# EasyEDA Pro project CogletESP_2026-02-24.epro, board Proto-Coglet_Reworked
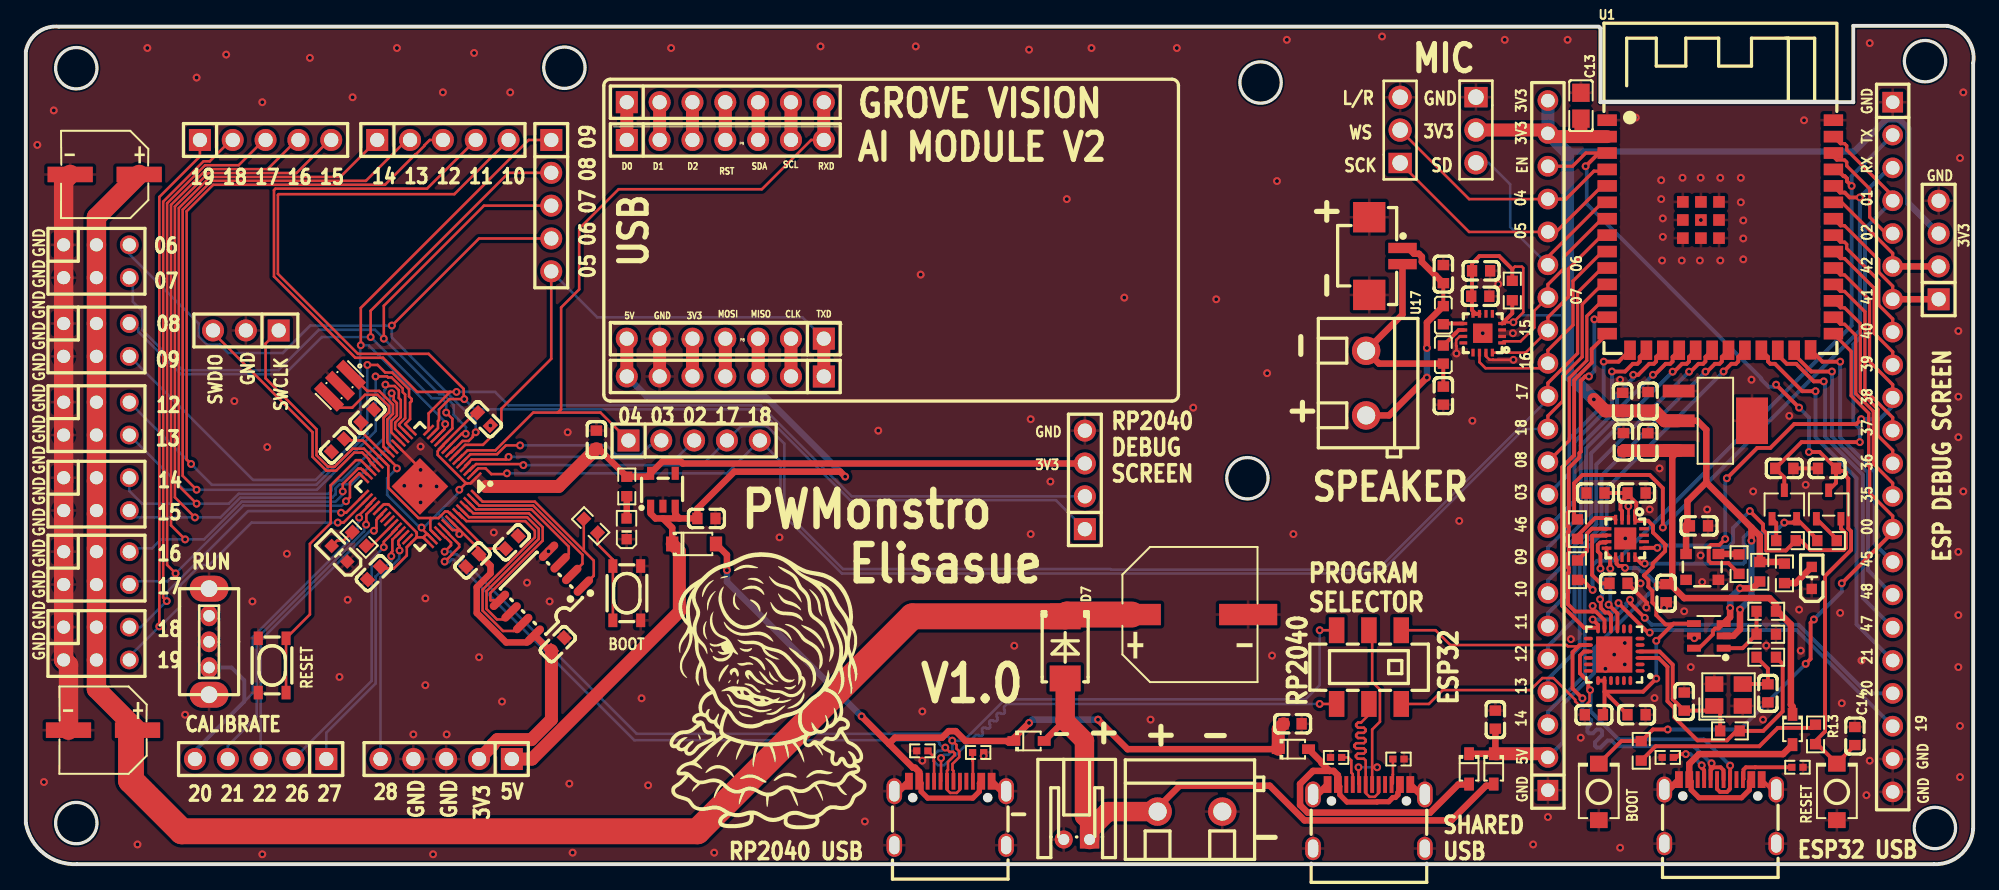
[diagram p7: board, top side]
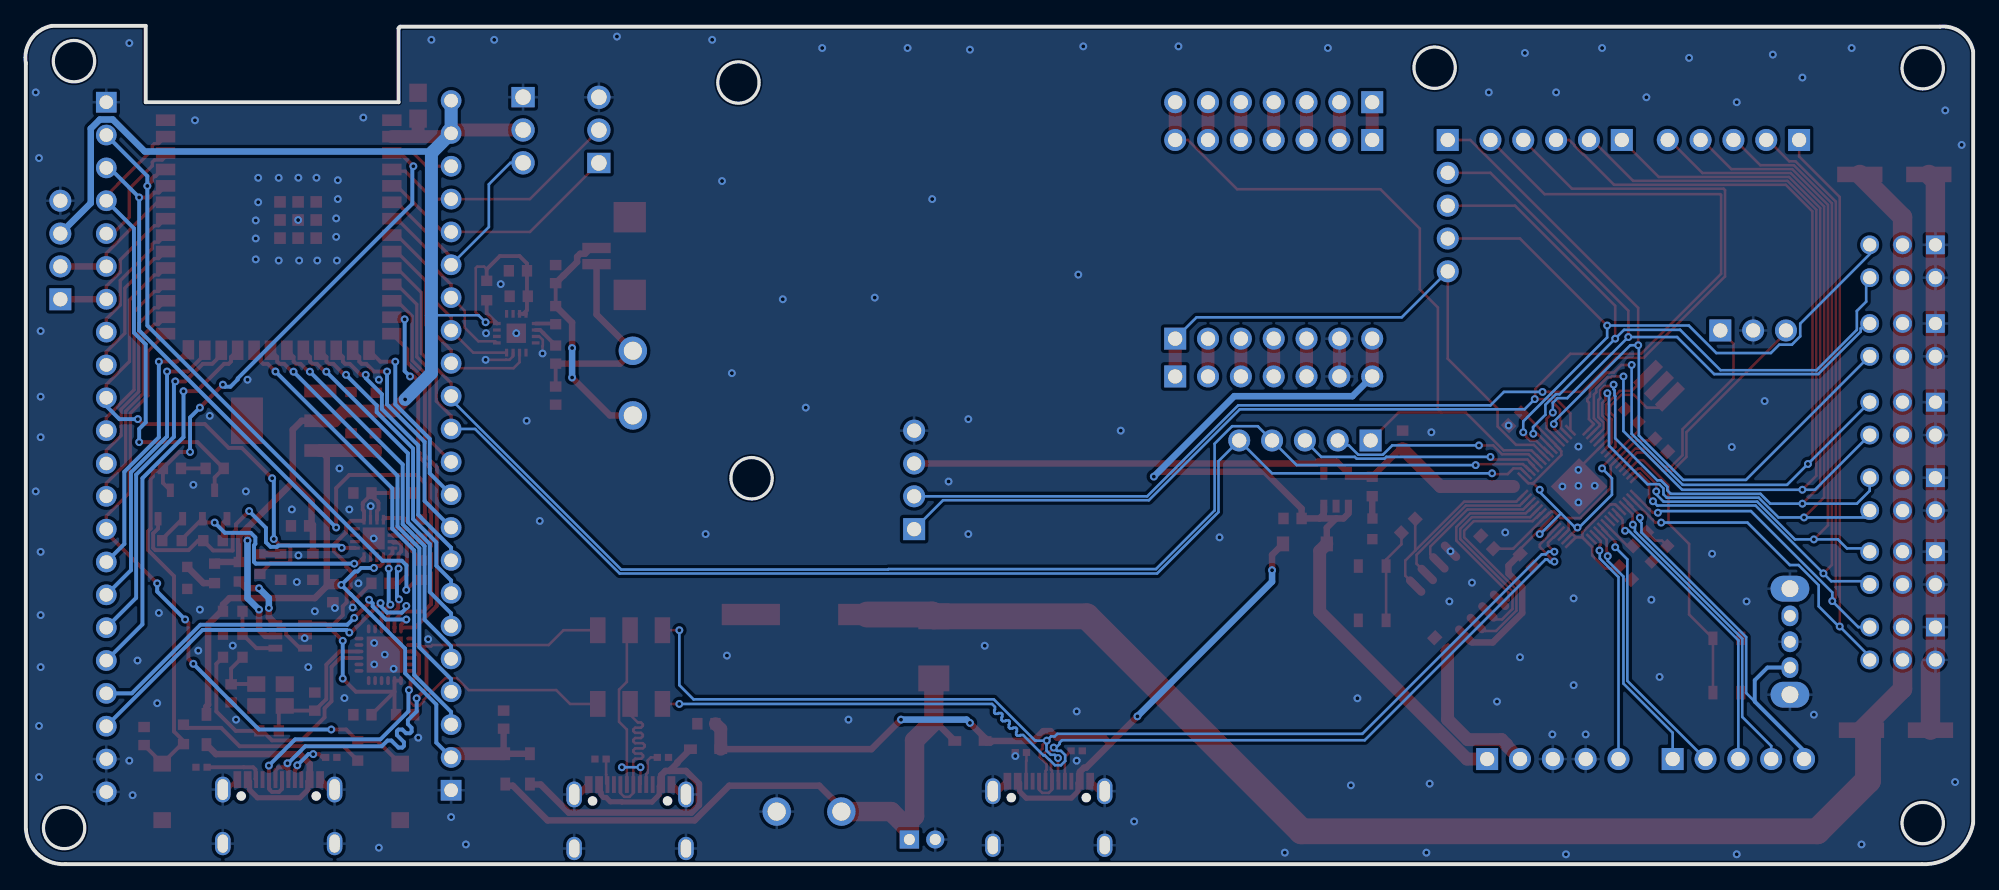
[diagram p8: board, bottom side, seen from below]

Outline 150.62 x 64.83 mm; copper layers: Top Layer, Bottom Layer. Coordinates in mm from the lower left corner of the outline.
Outline path: circle c3.9,61.56 r1.6 ; circle c3.9,3.17 r1.6 ; circle c41.66,61.59 r1.6 ; circle c94.49,29.84 r1.6 ; circle c95.5,60.45 r1.6 ; circle c146.9,62.1 r1.6 ; circle c147.66,2.79 r1.6 ; 0,62.86 0,3.17 arc(1.37,0.85) 3.94,0 147.57,0 arc(149.66,0.74) 150.62,2.72 150.62,61.94 arc(150.21,63.79) 148.62,64.83 141.35,64.83 141.35,58.93 121.79,58.93 121.79,64.64 121.67,64.77 2.58,64.77 arc(0.92,64.32) 0,62.86
Stack: Top Layer 0.035mm / Dielectric1 1.51mm FR4 er 4.5 / Bottom Layer 0.035mm

## Design rules (mm)
net USB_DM: DP1
net USB_DP: DP1
net D_N: DP3
net D_P: DP3
net DNIN: DP2
net DPIN: DP2
template: JLCPCB Capability(Two Layers Board)
spacing copperThickness1oz (default): track to track 0.102, other pairs 0.152 to 0.3
spacing copperThickness2oz: track to track 0.203, other pairs 0.152 to 0.3
track width copperThickness1oz (default): min 0.127, default 0.254, max 2.54
track width copperThickness2oz: min 0.203, default 0.254, max 2.54
differential pair differentialPair (default): width min 0.127, default 0.254, max 2.54; gap min 0.152, default 0.152
via viaSize (default): diameter min 0.5, default 0.61, max 10; hole min 0.3, default 0.305, max 6.3

## Placement (name value [footprint] x y rotation side)
C1  1uF  [C0603]  52.64 26.73 180 top
C2  10uF  [C0603]  113.67 11.18 270 top
C3  220uF  [CAP-SMD_BD6.3-L6.6-W6.6-FD]  5.97 10.36 180 top
C4  1uF  [C0603]  26.42 34.67 225 top
C5  1uF  [C0603]  24.13 32.38 45 top
C6  100nF  [C0603]  26.92 22.5 45 top
C7  100nF  [C0603]  34.54 23.49 45 top
C8  100nF  [C0603]  35.43 34.42 135 top
C9  100nF  [C0603]  37.59 24.89 225 top
C10  10uF  [C0603]  97.98 10.86 180 top
C11  1uF  [C0603]  44.13 32.83 270 top
C12  1uF  [C0603]  41.15 17.02 225 top
C13  10uF  [C0805]  120.28 58.66 270 top
C14  1uF  [C0603]  141.48 9.91 270 top
C15  1000uF  [CAP-SMD_BD10.0-L10.3-W10.3-FD]  90.04 19.3 0 top
C16  1uF  [C0603]  121.28 11.56 0 top
C17  1uF  [C0603]  124.59 11.56 180 top
C18  15pF  [C0603]  128.27 12.57 90 top
C19  15pF  [C0603]  134.75 13.21 270 top
C20  100nF  [C0603]  129.42 26.16 180 top
C21  220uF  [CAP-SMD_BD6.3-L6.6-W6.6-FD]  6.1 53.34 180 top
C22  100nF  [C0603]  124.59 28.7 0 top
C23  100nF  [C0603]  121.41 28.7 0 top
C24  100nF  [C0603]  123.19 21.72 180 top
C25  4.7uF  [C0603]  139.32 30.61 0 top
C26  1uF  [C0603]  136.02 30.61 180 top
C27  100nF  [C0603]  123.57 32.64 270 top
C30  100nF  [C0603]  123.51 35.75 270 top
C32  10uF  [C0603]  125.46 32.62 270 top
C33  10uF  [C0603]  125.48 35.81 270 top
C34  10uF  [C0603]  126.87 20.95 90 top
C35  10uF  [C0603]  112.5 43.92 180 top
C36  100nF  [C0603]  112.56 45.89 180 top
C37  220pF  [C0603]  109.64 36.23 90 top
C38  220pF  [C0603]  109.64 45.63 270 top
CN1  HC-1.25-2PWT  [CONN-SMD_2P-P1.25-HC-1.25-2PWT]  105.2 47.03 270 top
D1  DSK34  [SOD-123_L2.8-W1.8-LS3.7-RD]  51.69 24.76 0 top
D2  B5819WS  [SOD-323_L1.8-W1.3-LS2.5-RD]  113.54 7.37 270 top
D3  B5819WS  [SOD-323_L1.8-W1.3-LS2.5-RD]  136.65 10.41 270 top
D4  B5819WS  [SOD-323_L1.8-W1.3-LS2.5-RD]  98.04 8.89 0 top
D5  B5819WS  [SOD-323_L1.8-W1.3-LS2.5-RD]  111.63 7.37 270 top
D6  B5819WS  [SOD-323_L1.8-W1.3-LS2.5-RD]  77.6 9.53 0 top
D7  SS1045-SMB  [SMB_L4.4-W3.6-LS5.3-RD]  80.39 16.76 270 top
H1  PZ254V-11-05P  [HDR-TH_5P-P2.54-V-M]  32.51 8.13 180 top
H7  X6511WV-03H-C60D30  [HDR-TH_3P-P2.54-V-M]  17.02 41.27 180 top
H8  PZ254V-11-04P  [HDR-TH_4P-P2.54-V-M]  147.95 47.5 90 top
H9  PZ254V-11-04P  [HDR-TH_4P-P2.54-V-M]  81.92 29.72 90 top
H11  2.54-1*3P针  [HDR-TH_3P-P2.54-V-M-1]  106.3 56.77 90 top
H12  2.54-1*3P针  [HDR-TH_3P-P2.54-V-M-1]  112.16 56.78 270 top
H13  PZ254V-11-05P  [HDR-TH_5P-P2.54-V-M]  51.69 32.77 0 top
H14  PZ254V-11-05P  [HDR-TH_5P-P2.54-V-M]  40.64 50.93 270 top
H15  PZ254V-11-05P  [HDR-TH_5P-P2.54-V-M]  32.26 56.01 0 top
H16  PZ254V-11-05P  [HDR-TH_5P-P2.54-V-M]  18.54 56.01 0 top
H17  PZ254V-11-05P  [HDR-TH_5P-P2.54-V-M]  18.16 8.13 180 top
L1  BLM18PG121SN1D  [L0603]  109.64 42.46 270 top
L2  BLM18PG121SN1D  [L0603]  109.64 39.41 90 top
LED1  SML-D12P8WT86  [LED0603-RD_GREEN]  46.47 25.93 90 top
LED2  SML-D12D8WT86  [LED0603-R-RD_AMBER]  24.26 24 135 top
LED3  SML-D12D8WT86  [LED0603-R-RD_AMBER]  138.14 22.14 90 top
Q1  FDC6333C  [SOT-23-6_L2.9-W1.6-P0.95-LS2.8-BL]  130.18 17.65 90 top
Q2  S8050  [SOT-23-3_L3.0-W1.7-P0.95-LS2.9-BR]  136.02 27.81 270 top
Q3  S8050  [SOT-23-3_L3.0-W1.7-P0.95-LS2.9-BR]  139.45 27.81 270 top
R7  1kΩ  [R0603]  25.78 25.15 315 top
R8  1kΩ  [R0603]  46.48 29.21 90 top
R9  1kΩ  [R0603]  43.69 26.16 135 top
R11  5.1kΩ  [R0402]  69.34 8.76 0 top
R12  5.1kΩ  [R0402]  73.66 8.64 180 top
R13  10kΩ  [R0603]  138.43 10.03 90 top
R14  10kΩ  [R0603]  124.95 8.76 270 top
R15  100kΩ  [R0603]  134.62 19.56 180 top
R16  100kΩ  [R0603]  134.62 17.78 0 top
R17  100kΩ  [R0603]  134.12 22.61 270 top
R18  1kΩ  [R0603]  134.62 16 0 top
R19  1kΩ  [R0603]  131.81 10.3 180 top
R20  0Ω  [R0603]  132.52 23.2 90 top
R21  10kΩ  [R0603]  136.03 22.49 90 top
R22  0Ω  [R0603]  120.02 25.91 270 top
R23  0Ω  [R0603]  120.02 22.73 90 top
R24  12kΩ  [R0603]  139.32 25.02 180 top
R25  12kΩ  [R0603]  136.14 25.02 0 top
R26  5.1kΩ  [R0402]  127 8.25 0 top
R27  5.1kΩ  [R0402]  137.03 7.49 180 top
R28  1MΩ  [R0603]  114.98 44.36 90 top
R29  5.1kΩ  [R0402]  101.35 8.25 0 top
R30  5.1kΩ  [R0402]  106.17 8.13 180 top
SW1  SKRPACE010  [KEY-SMD_4P-L4.2-W3.2-P2.20-LS4.6]  46.48 20.95 90 top
SW2  SKRPACE010  [KEY-SMD_4P-L4.2-W3.2-P2.20-LS4.6]  19.05 15.37 270 top
SW3  TS-1088-AR02016  [SW-SMD_L3.9-W3.0-P4.45]  140.08 5.59 90 top
SW4  TS-1088-AR02016  [SW-SMD_L3.9-W3.0-P4.45]  121.67 5.59 90 top
SW5  MST22D18G2 125  [SW-SMD_MST22D18G2]  103.89 15.24 180 top
SW8  SS-12D02-VG4  [SW-TH_SS-12D02-VG4]  14.17 17.2 90 top
U1  ESP32-S3-WROOM-1-N16R8  [WIRELM-SMD_ESP32-S3-WROOM-1]  131.06 48.64 0 top
U2  HX PZ2.54-3x2P ZZ  [HDR-TH_6P-P2.54-V-M-R3-C2-S2.54_2]  5.46 40.54 270 top
U3  S2B-PH-K-S(LF)(SN)  [CONN-TH_S2B-PH-K-S-LF-SN]  81.28 1.91 0 top
U4  HX PZ2.54-3x2P ZZ  [HDR-TH_6P-P2.54-V-M-R3-C2-S2.54_2]  5.46 28.62 270 top
U5  HX PZ2.54-3x2P ZZ  [HDR-TH_6P-P2.54-V-M-R3-C2-S2.54_2]  5.46 34.46 270 top
U6  W25Q16JVSNIQ  [SOP-8_L4.9-W3.9-P1.27-LS6.0-BL]  39.88 20.95 135 top
U7  RP2040  [LQFN-56_L7.0-W7.0-P0.4-EP]  30.48 29.21 225 top
U8  MIC5504-3.3YM5-TR  [SOT-23-5_L3.0-W1.7-P0.95-LS2.8-TL]  49.28 28.96 90 top
U9  DS1021-1x22SF11-B  [HDR-TH_22P-P2.54-V-M]  144.4 32.26 270 top
U10  DS1021-1x22SF11-B  [HDR-TH_22P-P2.54-V-M]  117.73 32.38 90 top
U11  CH334F  [QFN-24_L4.0-W4.0-P0.50-BL-EP2.8]  122.86 16.2 90 top
U12  12MHz  [CRYSTAL-SMD_4P-L3.2-W2.5-BL]  131.7 13.08 0 top
U13  XL-3030RGBC-2812B  [LED-SMD_4P-L3.0-W3.0-P2.00-LS3.1_YKL-3030AY0203Z-001]  129.67 22.99 0 top
U14  CH343P  [TQFN-16_L3.0-W3.0-P0.50-BL-EP1.7]  123.72 25.19 180 top
U15  AMS1117-3.3  [SOT-223-4_L6.5-W3.5-P2.30-LS7.0-BR]  130.68 34.29 180 top
U16  MAX98357AETE+T  [TQFN-16_L3.0-W3.0-P0.50-BL-EP1.5]  112.69 41.06 90 top
U17  KF301-5.0-2P  [CONN-TH_P5.00_KF301-5.0-2P]  103.67 37.2 270 top
U18  HB-PH3-25417PB2GOP  [HDR-TH_7P-P2.54-V-M]  54.1 56.01 0 top
U19  HB-PH3-25417PB2GOP  [HDR-TH_7P-P2.54-V-M]  54.1 37.72 180 top
U20  HB-PH3-25417PB2GOP  [HDR-TH_7P-P2.54-V-M]  54.1 40.64 180 top
U21  HB-PH3-25417PB2GOP  [HDR-TH_7P-P2.54-V-M]  54.1 58.93 0 top
U22  HX PZ2.54-3x2P ZZ  [HDR-TH_6P-P2.54-V-M-R3-C2-S2.54_2]  5.46 46.63 270 top
U23  HX PZ2.54-3x2P ZZ  [HDR-TH_6P-P2.54-V-M-R3-C2-S2.54_2]  5.46 17.06 270 top
U24  HX PZ2.54-3x2P ZZ  [HDR-TH_6P-P2.54-V-M-R3-C2-S2.54_2]  5.46 22.9 270 top
U25  KF301-5.0-2P  [CONN-TH_P5.00_KF301-5.0-2P]  90.04 4.06 0 top
USBC1  TYPE-C-31-M-12  [USB-C_SMD-TYPE-C-31-M-12_1]  71.5 3.94 0 top
USBC2  TYPE-C-31-M-12  [USB-C_SMD-TYPE-C-31-M-12_1]  131.06 4.06 0 top
USBC3  TYPE-C-31-M-12  [USB-C_SMD-TYPE-C-31-M-12_1]  103.89 3.68 0 top
X1  12MHz  [CRYSTAL-SMD_3P-L3.2-W1.3-P1.2-BL]  24.3 37 225 top

## Footprints (pads in the part's own frame, mm; a bottom-side part is the same pattern mirrored in y, then rotated)
C0603
  rect 0.8x0.9 smd: 1(-0.7,0) 2(0.7,0)
C0805
  rect 1.41x1.35 smd: 1(-1,0) 2(1,0)
CAP-SMD_BD6.3-L6.6-W6.6-FD
  rect 3.5x1.2 smd: 1(-2.67,0) 2(2.67,0)
CAP-SMD_BD10.0-L10.3-W10.3-FD
  rect 4.5x1.65 smd: 1(-4.5,0) 2(4.5,0)
CONN-SMD_2P-P1.25-HC-1.25-2PWT
  rect 0.8x2.2 smd: 1(-0.625,1.285) 2(0.625,1.285)
  rect 2.35x2.5 smd: 3(-3.005,-1.285) 4(3.005,-1.285)
CONN-TH_P5.00_KF301-5.0-2P
  round 2.2 hole 1.4: 1(-2.5,0) 2(2.5,0)
CONN-TH_S2B-PH-K-S-LF-SN
  rect 1.5x1.4 hole 0.85: 1(1,0)
  round 1.4 hole 0.85: 2(-1,0)
CRYSTAL-SMD_3P-L3.2-W1.3-P1.2-BL
  rect 0.8x2.5 smd: 1(-1.2,0) 2(0,0) 3(1.2,0)
CRYSTAL-SMD_4P-L3.2-W2.5-BL
  rect 1.4x1.2 smd: 1(-1.1,-0.85) 2(1.1,-0.85) 3(1.1,0.85) 4(-1.1,0.85)
HDR-TH_3P-P2.54-V-M
  rect 1.7x1.7 hole 1.1: 1(-2.54,0)
  round 1.7 hole 1.1: 2(0,0) 3(2.54,0)
HDR-TH_3P-P2.54-V-M-1
  rect 1.575x1.8 hole 1.2: 1(-2.54,0)
  round 1.8 hole 1.2: 2(0,0) 3(2.54,0)
HDR-TH_4P-P2.54-V-M
  rect 1.7x1.7 hole 1.1: 1(-3.81,0)
  round 1.7 hole 1.1: 2(-1.27,0) 3(1.27,0) 4(3.81,0)
HDR-TH_5P-P2.54-V-M
  rect 1.7x1.7 hole 1.1: 1(-5.08,0)
  round 1.7 hole 1.1: 2(-2.54,0) 3(0,0) 4(2.54,0) 5(5.08,0)
HDR-TH_6P-P2.54-V-M-R3-C2-S2.54_2
  round 1.45 hole 1.02: 1(1.27,2.54) 2(-1.27,2.54) 3(-1.27,0) 4(1.27,0) 5(1.27,-2.54)
  rect 1.45x1.45 hole 1.02: 6(-1.27,-2.54)
HDR-TH_7P-P2.54-V-M
  rect 1.7x1.7 hole 1.1: 1(-7.62,0)
  round 1.7 hole 1.1: 2(-5.08,0) 3(-2.54,0) 4(0,0) 5(2.54,0) 6(5.08,0) 7(7.62,0)
HDR-TH_22P-P2.54-V-M
  rect 1.6x1.6 hole 1.05: 1(-26.67,0)
  round 1.6 hole 1.05: 2(-24.13,0) 3(-21.59,0) 4(-19.05,0) 5(-16.51,0) 6(-13.97,0) 7(-11.43,0) 8(-8.89,0) 9(-6.35,0) 10(-3.81,0) 11(-1.27,0) 12(1.27,0) 13(3.81,0) 14(6.35,0) 15(8.89,0) 16(11.43,0) 17(13.97,0) 18(16.51,0) 19(19.05,0) 20(21.59,0) 21(24.13,0) 22(26.67,0)
KEY-SMD_4P-L4.2-W3.2-P2.20-LS4.6
  rect 1.05x0.7 smd: 1(-2.1,1.075) 2(2.1,1.075) 3(-2.1,-1.075) 4(2.1,-1.075)
L0603
  rect 0.8x0.864 smd: 1(-0.7,0) 2(0.7,0)
LED0603-R-RD_AMBER
  rect 0.8x0.8 smd: 1(0.851,0) 2(-0.851,0)
LED0603-RD_GREEN
  rect 0.8x0.8 smd: 1(-0.799,-0.004) 2(0.799,0.004)
LED-SMD_4P-L3.0-W3.0-P2.00-LS3.1_YKL-3030AY0203Z-001
  rect 0.9x0.8 smd: 1(-1.25,1) 2(-1.25,-1) 3(1.25,-1) 4(1.25,1)
LQFN-56_L7.0-W7.0-P0.4-EP
  rect 1.1x0.2 smd: 1(-3.55,2.6) 2(-3.55,2.2) 3(-3.55,1.8) 4(-3.55,1.4) 5(-3.55,1) 6(-3.55,0.6) 7(-3.55,0.2) 8(-3.55,-0.2) 9(-3.55,-0.6) 10(-3.55,-1) 11(-3.55,-1.4) 12(-3.55,-1.8) 13(-3.55,-2.2) 14(-3.55,-2.6) 29(3.55,-2.6) 30(3.55,-2.2) 31(3.55,-1.8) 32(3.55,-1.4) 33(3.55,-1) 34(3.55,-0.6) 35(3.55,-0.2) 36(3.55,0.2) 37(3.55,0.6) 38(3.55,1) 39(3.55,1.4) 40(3.55,1.8) 41(3.55,2.2) 42(3.55,2.6)
  rect 0.2x1.1 smd: 15(-2.6,-3.55) 16(-2.2,-3.55) 17(-1.8,-3.55) 18(-1.4,-3.55) 19(-1,-3.55) 20(-0.6,-3.55) 21(-0.2,-3.55) 22(0.2,-3.55) 23(0.6,-3.55) 24(1,-3.55) 25(1.4,-3.55) 26(1.8,-3.55) 27(2.2,-3.55) 28(2.6,-3.55) 43(2.6,3.55) 44(2.2,3.55) 45(1.8,3.55) 46(1.4,3.55) 47(1,3.55) 48(0.6,3.55) 49(0.2,3.55) 50(-0.2,3.55) 51(-0.6,3.55) 52(-1,3.55) 53(-1.4,3.55) 54(-1.8,3.55) 55(-2.2,3.55) 56(-2.6,3.55)
  rect 3.1x3.1 smd: 57(0,0)
QFN-24_L4.0-W4.0-P0.50-BL-EP2.8
  oval 0.28x0.7 smd: 1(-1.25,-2) 2(-0.75,-2) 3(-0.25,-2) 4(0.25,-2) 5(0.75,-2) 6(1.25,-2) 13(1.25,2) 14(0.75,2) 15(0.25,2) 16(-0.25,2) 17(-0.75,2) 18(-1.25,2)
  oval 0.7x0.28 smd: 7(2,-1.25) 8(2,-0.75) 9(2,-0.25) 10(2,0.25) 11(2,0.75) 12(2,1.25) 19(-2,1.25) 20(-2,0.75) 21(-2,0.25) 22(-2,-0.25) 23(-2,-0.75) 24(-2,-1.25)
  rect 2.8x2.8 smd: 25(0.013,0)
R0402
  rect 0.566x0.54 smd: 1(-0.433,0) 2(0.433,0)
R0603
  rect 0.806x0.864 smd: 1(-0.753,0) 2(0.753,0)
SMB_L4.4-W3.6-LS5.3-RD
  rect 2x2.4 smd: 1(-2.4,0) 2(2.4,0)
SOD-123_L2.8-W1.8-LS3.7-RD
  rect 0.95x1.15 smd: 1(-1.692,0) 2(1.692,0)
SOD-323_L1.8-W1.3-LS2.5-RD
  rect 1x0.75 smd: 1(-1.173,0) 2(1.173,0)
SOP-8_L4.9-W3.9-P1.27-LS6.0-BL
  oval 0.63x1.865 smd: 1(-1.905,-2.683) 2(-0.635,-2.683) 3(0.635,-2.683) 4(1.905,-2.683) 5(1.905,2.683) 6(0.635,2.683) 7(-0.635,2.683) 8(-1.905,2.683)
SOT-23-3_L3.0-W1.7-P0.95-LS2.9-BR
  rect 1.038x0.532 smd: 1(1.101,-0.95) 2(1.101,0.95) 3(-1.101,0)
SOT-23-5_L3.0-W1.7-P0.95-LS2.8-TL
  rect 1x0.55 smd: 1(-1.272,0.95) 2(-1.272,0) 3(-1.272,-0.95) 4(1.272,-0.95) 5(1.272,0.95)
SOT-23-6_L2.9-W1.6-P0.95-LS2.8-BL
  rect 0.532x1.072 smd: 1(-0.95,-1.149) 2(0,-1.149) 3(0.95,-1.149) 4(0.95,1.149) 5(0,1.149) 6(-0.95,1.149)
SOT-223-4_L6.5-W3.5-P2.30-LS7.0-BR
  rect 2.47x0.98 smd: 1(2.835,-2.3) 2(2.835,0) 3(2.835,2.3)
  rect 2.47x3.6 smd: 4(-2.835,0)
SW-SMD_L3.9-W3.0-P4.45
  rect 1.23x1.36 smd: 1(-2.185,0) 2(2.185,0)
SW-SMD_MST22D18G2
  rect 1.2x2 smd: 1(-2.5,2.85) 2(0,2.85) 3(2.5,2.85) 4(-2.5,-2.85) 5(0,-2.85) 6(2.5,-2.85)
SW-TH_SS-12D02-VG4
  oval 1.6x1.3 hole 0.9: 1(-2,0) 2(-0.006,0) 3(2,0)
  oval 2x3 hole 1.3: 4(4.1,0) 5(-4.1,0)
TQFN-16_L3.0-W3.0-P0.50-BL-EP1.5
  rect 0.25x0.6 smd: 1(-0.749,-1.5) 2(-0.248,-1.5) 3(0.252,-1.5) 4(0.751,-1.5) 9(0.75,1.5) 10(0.25,1.5) 11(-0.25,1.5) 12(-0.749,1.5)
  rect 0.6x0.25 smd: 5(1.5,-0.748) 6(1.5,-0.248) 7(1.5,0.252) 8(1.5,0.752) 13(-1.5,0.752) 14(-1.5,0.252) 15(-1.5,-0.248) 16(-1.5,-0.748)
  rect 1.5x1.5 smd: 17(0,0)
TQFN-16_L3.0-W3.0-P0.50-BL-EP1.7
  rect 0.25x0.75 smd: 1(-0.749,-1.45) 2(-0.248,-1.45) 3(0.252,-1.45) 4(0.751,-1.45) 9(0.75,1.45) 10(0.25,1.45) 11(-0.25,1.45) 12(-0.749,1.45)
  rect 0.75x0.25 smd: 5(1.45,-0.75) 6(1.45,-0.25) 7(1.45,0.25) 8(1.45,0.75) 13(-1.45,0.75) 14(-1.45,0.25) 15(-1.45,-0.25) 16(-1.45,-0.75)
  rect 1.7x1.7 smd: 17(0.001,0)
USB-C_SMD-TYPE-C-31-M-12_1
  oval 1.2x2 hole 0.8x1.6: 1(4.325,1.706) 4(-4.325,1.706)
  oval 1.2x1.8 hole 0.8x1.4: 2(4.325,-2.474) 3(-4.325,-2.474)
  custom 0.6x1.3 smd: A1B12(-3.2,2.474) A4B9(-2.4,2.474) B1A12(3.2,2.474) B4A9(2.401,2.474)
  rect 0.3x1.3 smd: A5(-1.25,2.474) A6(-0.25,2.474) A7(0.25,2.474) A8(1.25,2.474) B5(1.75,2.474) B6(0.75,2.474) B7(-0.75,2.474) B8(-1.75,2.474)
WIRELM-SMD_ESP32-S3-WROOM-1
  rect 1.5x0.9 smd: 1(-8.75,8.895) 2(-8.75,7.625) 3(-8.75,6.355) 4(-8.75,5.085) 5(-8.75,3.815) 6(-8.75,2.545) 7(-8.75,1.275) 8(-8.75,0.005) 9(-8.75,-1.265) 10(-8.75,-2.535) 11(-8.75,-3.805) 12(-8.75,-5.075) 13(-8.75,-6.345) 14(-8.75,-7.615) 27(8.75,-7.615) 28(8.75,-6.345) 29(8.75,-5.075) 30(8.75,-3.805) 31(8.75,-2.535) 32(8.75,-1.265) 33(8.75,0.005) 34(8.75,1.275) 35(8.75,2.545) 36(8.75,3.815) 37(8.75,5.085) 38(8.75,6.355) 39(8.75,7.625) 40(8.75,8.895)
  rect 0.9x1.5 smd: 15(-6.985,-8.895) 16(-5.715,-8.895) 17(-4.445,-8.895) 18(-3.175,-8.895) 19(-1.905,-8.895) 20(-0.635,-8.895) 21(0.635,-8.895) 22(1.905,-8.895) 23(3.175,-8.895) 24(4.445,-8.895) 25(5.715,-8.895) 26(6.985,-8.865)
  rect 0.9x0.9 smd: 41(-2.9,2.575) 41(-2.9,1.175) 41(-2.9,-0.225) 41(-1.5,2.575) 41(-1.5,1.175) 41(-1.5,-0.225) 41(-0.1,2.575) 41(-0.1,1.175) 41(-0.1,-0.225)

## Nets
1V1: C5.2 C9.2 U7.23 U7.45 U7.50
3V3: C4.2 C6.2 C7.2 C8.2 C11.2 C12.2 H1.2 H9.3 R8.2 U6.8 U7.1 U7.10 U7.22 U7.33 U7.42 U7.43 U7.44 U7.48 U7.49 U8.5
3V3_OP: C16.2 C17.2 C22.1 C23.2 Q1.4 U11.19 U11.20 U14.1 U14.3
GND: C1.1 C2.1 C3.2 C4.1 C5.1 C6.1 C7.1 C8.1 C9.1 C10.1 C11.1 C12.1 C13.1 C14.1 C15.2 C16.1 C17.1 C18.2 C19.2 C20.1 C21.2 C22.2 C23.1 C24.1 C25.1 C26.1 C27.1 C30.1 C32.1 C33.1 C34.1 C35.1 C36.1 C37.1 C38.1 CN1.3 CN1.4 H1.3 H1.4 H7.2 H8.4 H9.4 H11.3 H12.1 LED1.1 LED2.2 LED3.2 Q1.5 R11.1 R12.1 R16.2 R26.1 R27.1 R29.1 R30.1 SW1.3 SW1.4 SW2.3 SW2.4 SW3.1 SW4.1 SW8.2 SW8.4 SW8.5 U1.1 U1.40 U1.41 U2.5 U2.6 U3.2 U4.5 U4.6 U5.5 U5.6 U6.4 U7.19 U7.57 U8.2 U9.1 U9.21 U9.22 U10.1 U11.25 U12.2 U12.4 U13.3 U14.2 U14.17 U15.1 U15.4 U16.2 U16.3 U16.11 U16.15 U16.17 U19.6 U20.6 U22.5 U22.6 U23.5 U23.6 U24.5 U24.6 U25.2 USBC1.1 USBC1.2 USBC1.3 USBC1.4 USBC1.A1B12 USBC1.B1A12 USBC2.1 USBC2.2 USBC2.3 USBC2.4 USBC2.A1B12 USBC2.B1A12 USBC3.1 USBC3.2 USBC3.3 USBC3.4 USBC3.A1B12 USBC3.B1A12 X1.2
VBUS: C10.2 D1.2 D4.1 D6.1 USBC1.A4B9 USBC1.B4A9
VBUSINESP: C2.2 C27.2 C32.2 C34.2 D2.1 D3.1 D5.1 R15.1 U10.2 U14.9 U15.3
#EN: C14.2 C25.2 Q3.3 R13.1 SW3.2 U1.3 U10.20
D_N: SW5.4 U11.14 USBC2.A7 USBC2.B7
D_P: SW5.1 U11.15 USBC2.A6 USBC2.B6
DNIN: SW5.5 USBC3.A7 USBC3.B7
DPIN: SW5.2 USBC3.A6 USBC3.B6
DTR: Q2.2 R24.2 U14.12
EIO0: R14.1 SW4.2 U1.27 U9.14
EIO1: C26.2 Q2.3 U1.39 U9.4
EIO2: U1.38 U9.5
EIO3: U1.15 U10.10
EIO4: H11.2 U1.4 U10.19
EIO5: H11.1 U1.5 U10.18
EIO6: H12.3 U1.6 U10.17
EIO7: U1.7 U10.16 U16.1
EIO8: U1.12 U10.11
EIO9: U1.17 U10.8
EIO10: U1.18 U10.7
EIO11: U1.19 U10.6
EIO12: U1.20 U10.5
EIO13: U1.21 U10.4
EIO14: U1.22 U10.3
EIO15: U1.8 U10.15 U16.16
EIO16: U1.9 U10.14 U16.14
EIO17: H13.4 U1.10 U7.3 U10.13
EIO18: H13.5 U1.11 U7.2 U10.12
EIO19: U1.13 U9.20 U11.11
EIO20: U1.14 U9.19 U11.12
EIO21: U1.23 U9.18
EIO35: U1.28 U9.13
EIO36: U1.29 U9.12
EIO37: U1.30 U9.11
EIO38: R20.1 U1.31 U9.10
EIO39: U1.32 U9.9
EIO40: U1.33 U9.8
EIO41: H8.1 U1.34 U9.7
EIO42: H8.2 U1.35 U9.6
EIO45: U1.26 U9.15
EIO46: U1.16 U10.9
EIO47: U1.24 U9.17
EIO48: U1.25 U9.16
EIORX: R22.1 U1.36 U9.3
EIOTX: R23.1 U1.37 U9.2
ESP3V3: R13.2 R14.2
GPIO2: H13.3 U7.4
GPIO3: H13.2 U7.5
GPIO4: H13.1 U7.6 U18.7 U21.7
GPIO5: H14.5 U7.7 U19.1 U20.1
GPIO6: H14.4 U7.8 U22.2
GPIO7: H14.3 U7.9 U22.1
GPIO8: H14.2 U2.2 U7.11
GPIO9: H14.1 U2.1 U7.12
GPIO10: H9.1 H15.5 U7.13
GPIO11: H9.2 H15.4 U7.14
GPIO12: H15.3 U5.2 U7.15
GPIO13: H15.2 U5.1 U7.16
GPIO14: H15.1 U4.2 U7.17
GPIO15: H16.5 U4.1 U7.18
GPIO16: H16.4 U7.27 U24.2
GPIO17: H16.3 U7.28 U24.1
GPIO18: H16.2 U7.29 U23.2
GPIO19: H16.1 U7.30 U23.1
GPIO20: H17.5 SW8.1 U7.31
GPIO21: H17.4 U7.32
GPIO22: H17.3 U7.34
GPIO26: H17.2 U7.38
GPIO27: H17.1 U7.39
GPIO28: H1.5 U7.40
MAXVDD: C13.2 C20.2 C30.2 C33.2 C35.2 C36.2 H8.3 H12.2 Q1.2 R17.1 R21.2 R28.1 R28.2 U1.2 U10.21 U10.22 U13.1 U15.2 U16.4 U16.7 U16.8
NET15: L1.2 U16.9
NET16: L2.2 U16.10
QSPI_SCLK: U6.6 U7.52
QSPI_SD0: U6.5 U7.53
QSPI_SD1: U6.2 U7.55
QSPI_SD2: U6.3 U7.54
QSPI_SD3: U6.7 U7.51
QSPI_SS: R9.2 U6.1 U7.56
RGB_CTRL: R20.2 U13.4
RTS: Q3.2 R25.2 U14.13
RUN: SW2.1 SW2.2 U7.26
SWCLK: H7.1 U7.24
SWDIO: H7.3 U7.25
USB2_N: U11.9 U14.8
USB2_P: U11.10 U14.7
USB_DM: SW5.6 U7.46 USBC1.A7 USBC1.B7
USB_DP: SW5.3 U7.47 USBC1.A6 USBC1.B6
V+: C3.1 C15.1 C21.1 D7.1 U2.3 U2.4 U4.3 U4.4 U5.3 U5.4 U22.3 U22.4 U23.3 U23.4 U24.3 U24.4
VSYS: C1.2 D1.1 H1.1 U8.1 U8.3 U19.7 U20.7
XI: C18.1 R19.2 U11.4 U12.1
XO: R18.2 R19.1 U11.3
$1N1870: R9.1 SW1.1 SW1.2
$1N1872: U7.21 X1.3
$1N1873: U7.20 X1.1
$1N1896: LED2.1 R7.1
$1N1897: R7.2 U7.37
$1N2181: R12.2 USBC1.B5
$1N2182: R11.2 USBC1.A5
$1N3810: Q1.1 R15.2 R16.1
$1N3984: Q1.3 Q1.6 R17.2
$1N4724: C19.1 R18.1 U12.3
$1N5316: LED3.1 R21.1
$1N6114: R22.2 U14.4
$1N6119: R23.2 U14.5
$1N6176: C24.2 U14.6
$1N6413: Q3.1 R24.1
$1N6452: Q2.1 R25.1
$1N6986: D3.2 USBC2.A4B9 USBC2.B4A9
$1N7041: R26.2 USBC2.A5
$1N7109: R27.2 USBC2.B5
$1N7689: LED1.2 R8.1
$1N13425: C38.2 CN1.1 L1.1 U17.2
$1N13429: C37.2 CN1.2 L2.1 U17.1
$1N14871: U19.2 U20.2
$1N14876: U19.3 U20.3
$1N14881: U19.4 U20.4
$1N14886: U19.5 U20.5
$1N14907: U18.1 U21.1
$1N14912: U18.2 U21.2
$1N14917: U18.3 U21.3
$1N14922: U18.4 U21.4
$1N14927: U18.5 U21.5
$1N14932: U18.6 U21.6
$1N15236: R30.2 USBC3.B5
$1N15239: D4.2 D5.2 USBC3.A4B9 USBC3.B4A9
$1N15244: R29.2 USBC3.A5
$1N16557: D2.2 D6.2 D7.2 U3.1 U25.1

Pads without a net: SW8 3; U7 35 36 41; U8 4; U11 1 2 5 6 7 8 13 16 17 18 21 22 23 24; U13 2; U14 10 11 14 15 16; U16 5 6 12 13; USBC1 A8 B8; USBC2 A8 B8; USBC3 A8 B8

## Via types
v1: diameter 0.61, hole 0.305, Top Layer to Bottom Layer, 267 vias

## Routing (per net, layer and track width the routed paths; a pad name or vN(x,y) marks a point on that pad's centre or on a via; arc(x,y) is an arc through that point)
1V1: length 18.6
  Top Layer w0.2: 31.29,26.77 31.92,26.77 32.43,27.27 32.63,27.27 33.06,26.84 33.13,26.84 35.58,24.4 C9.2 ; 31.29,26.77 30.38,26.77 28.04,29.11 28.04,30.81 U7.23 26.08,32.77 24.87,32.77 ; 31.29,26.76 31.29,25.86 U7.45
3V3: length 117.3
  Top Layer w0.2: 33.57,25.84 33.53,25.79 v1(33.53,25.53) ; 33.57,25.84 33,25.84 U7.48 ; 33.57,25.84 U7.49 ; 33.57,25.84 35.04,24.37 C7.2 ; v1(33.53,28.96) 34.02,29.45 34.12,29.45 ; 30.22,25.27 U7.42 29.46,24.52 29.46,23.88 28.45,22.86 27.56,22.86 C6.2 ; 30.22,25.27 30.74,25.27 ; 30.22,25.27 30.22,25.34 30.24,25.36 30.24,25.57 30.22,25.58 30.22,25.66 28.07,27.81 27.99,27.81 27.97,27.84 27.76,27.84 27.74,27.81 27.67,27.81 U7.33 ; U7.44 31.05,25.53 ; 31.05,25.53 30.61,25.97 v1(30.61,26.03) ; 31.05,25.53 30.99,25.53 30.74,25.28 30.74,25.27 ; U7.1 34.4,29.45 34.12,29.45 ; 34.12,29.45 34.11,29.46 34.04,29.46 31.85,31.65 31.85,31.93 32.28,32.36 U7.10 34.77,34.91 34.94,34.91 ; 30.74,25.27 31.15,24.86 ; v1(28.7,30.61) 28.7,30.71 U7.22 25.92,33.49 C4.2
  Top Layer w0.5: C7.2 35.94,23.09 35.94,22.48 34.88,21.42 34.88,19.42 37.15,17.14 38.76,17.14 39.33,17.71 40.52,16.52 40.65,16.52 ; H9.3 50.81,30.99 50.67,31.13 49.23,31.13 U8.5 48.06,29.96 R8.2 44.31,32.13 C11.2
  Top Layer w1: 40.65,16.52 40.65,11.19 39.09,9.63 36.47,9.63 36.09,9.25 36.09,9.17 H1.2 ; 35.56,29.21 41.21,29.21 C11.2
  Bottom Layer w0.2: 31.88,27.13 33.49,25.53 v1(33.53,25.53) ; 31.88,27.13 30.78,26.03 v1(30.61,26.03) 30.48,26.03 27.94,28.57 27.94,29.84 v1(28.7,30.61) ; 31.88,27.13 33.53,28.78 v1(33.53,28.96)
3V3_OP: length 34.2
  Top Layer w0.3: 122.11,13.34 U11.20 U11.19 ; 122.11,13.34 122.11,11.68 C16.2 ; 122.11,13.34 C17.2 ; 122.11,13.34 125.1,13.34 v1(126.11,14.35) ; 127.31,18.48 127.44,18.6 Q1.4 ; 127.31,18.48 v1(126.11,17.27) ; 127.31,18.48 127.25,18.54 126.82,18.54 126.11,19.26 126.11,19.94 125.81,20.24 125.81,21.13 125.49,21.45 125.5,21.47 125.5,21.97 125.15,22.32 125.16,22.32 125.83,22.99 125.83,23.24 126.8,24.21 126.8,24.62 126.85,24.66 125.86,25.65 125.86,26.18 125.48,26.55 124.55,26.55 U14.1 124.46,27.31 124.57,27.41 124.57,27.83 124.56,27.84 124.56,27.94 124.08,28.42 123.98,28.42 123.92,28.37 ; U14.3 123.46,27.32 123.34,27.43 123.34,27.94 123.39,27.98 123.39,28.04 123.89,28.46 ; 122.11,28.7 C22.1
  Bottom Layer w0.3: v1(126.11,14.35) v1(126.11,17.27)
GND: length 67.3
  Top Layer w0.2: U7.19 30.53,30.57 v1(30.53,30.49) ; U14.2 123.96,27.67 v1(123.95,27.69) ; v1(110.66,39.5) 110.66,40.06 110.64,40.08 110.64,40.54 110.91,40.81 U16.11 ; U16.15 112.94,39.28 113.21,39.01 113.49,39.01 113.49,39 v1(115.06,39)
  Top Layer w0.3: v1(125.34,19.85) 125.34,20.13 125.41,20.2 C24.1 ; C26.1 C25.1 ; USBC2.1 135.03,5.77 USBC2.B1A12
  Top Layer w0.5: 100.69,6.16 99.92,5.39 USBC3.4 ; USBC1.B1A12 75.47,5.64 USBC1.1 ; USBC3.B1A12 107.85,5.39 USBC3.1 ; USBC2.4 127.1,5.77 USBC2.A1B12 ; USBC1.A1B12 67.53,5.64 USBC1.4
  Top Layer w1: U19.6 U20.6
  Top Layer w1.5: C21.2 2.92,52.83 U22.6 U22.5 U2.6 U2.5 U5.6 U5.5 U23.6 U23.5 3.3,15.41 C3.2
  vias: v1(0.89,55.63) v1(1.4,6.35) v1(2.16,58.29) v1(8.64,1.52) v1(9.4,63.12) v1(12.32,11.56) v1(13.21,60.83) v1(15.49,62.61) v1(16.13,35.81) v1(17.53,20.32) v1(18.29,58.93) v1(18.29,0.76) v1(18.67,32.26) v1(20.19,24) v1(21.97,62.36) v1(24.26,14.48) v1(24.89,20.45) v1(25.27,59.31) v1(28.7,63.12) v1(29.27,29.26) v1(29.97,10.03) v1(30.53,32.29) v1(30.53,29.26) v1(30.53,27.98) v1(30.9,20.56) v1(30.9,13.84) v1(31.5,0.76) v1(31.77,29.21) v1(32.26,59.69) v1(32.55,10.03) v1(34.67,62.74) v1(35.05,16) v1(35.93,33.92) v1(36.19,25.65) v1(36.83,12.57) v1(37.46,59.69) v1(38.77,21.77) v1(40.43,24.2) v1(40.51,20.32) v1(41.91,33.4) v1(42.04,6.22) v1(42.29,0.89) v1(47.62,12.83) v1(48.13,6.1) v1(49.91,63.12) v1(53.24,0.89) v1(58.29,25.27) v1(61.47,63.25) v1(64.9,3.3) v1(65.93,33.53) v1(68.83,63.25) v1(69.21,45.59) v1(69.34,11.81) v1(69.34,8) v1(74.09,8.36) v1(76.45,16.89) v1(77.6,62.99) v1(77.72,34.41) v1(77.72,25.53) v1(79.25,29.59) v1(80.52,51.43) v1(82.42,63.12) v1(84.96,43.81) v1(86.99,11.18) v1(89.03,63.12) v1(90.3,35.31) v1(92.08,43.69) v1(96.01,37.97) v1(96.39,16.13) v1(96.77,52.83) v1(97.54,63.75) v1(98.04,25.53) v1(104.9,64.01) v1(110.87,26.54) v1(111.89,34.29) v1(112.69,41.06) v1(113.89,44.86) v1(114.39,63.75) v1(115.03,41.06) v1(116.59,1.52) v1(117.73,3.64) v1(119.25,63.75) v1(119.51,17.4) v1(120.27,9.78) v1(122.17,15.11) v1(122.86,16.21) v1(123.32,37.46) v1(123.32,1.27) v1(123.72,25.19) v1(123.68,17.1) v1(123.68,15.45) v1(124.52,57.74) v1(124.9,21.72) v1(125.6,27.43) v1(125.98,12.84) v1(126.36,30.61) v1(126.49,52.9) v1(126.49,51.43) v1(126.62,49.94) v1(126.62,48.51) v1(126.56,46.68) v1(126.72,19.81) v1(128.14,53.09) v1(128.08,46.68) v1(128.27,19.56) v1(128.78,15.24) v1(129.06,17.48) v1(129.55,53.09) v1(129.48,46.68) v1(129.54,23.88) v1(129.56,49.82) v1(129.66,21.82) v1(130.05,27.43) v1(131.06,53.08) v1(131.06,46.68) v1(132.65,53.08) v1(132.65,51.19) v1(132.84,49.78) v1(132.84,48.39) v1(132.84,46.78) v1(133.48,37.46) v1(133.6,28.83) v1(134.37,11.18) v1(134.62,16.9) v1(136.4,34.67) v1(137.16,19.68) v1(137.29,16.51) v1(137.54,57.53) v1(137.67,29.34) v1(140.33,19.43) v1(140.46,12.45) v1(141.99,15.75) v1(142.37,5.33) v1(142.62,63.5) v1(142.62,8) v1(149.48,41.23) v1(149.48,36.15) v1(149.48,33.02) v1(149.48,24.15) v1(149.48,19.26) v1(149.48,15.24) v1(149.61,54.61) v1(149.61,10.69) v1(149.61,6.73) v1(149.86,59.69) v1(149.86,28.83)
VBUS: length 66.4
  Top Layer w0.4: USBC1.A4B9 69.25,6.26 69.25,5.62 69.76,5.11 73.24,5.11 73.75,5.62 73.75,6.26 USBC1.B4A9
  Top Layer w0.5: USBC1.A4B9 69.1,7.13 68.77,7.46 68.61,7.46 66.76,9.31 ; 66.76,9.31 67.23,9.78 70.87,9.78 71.37,10.29 71.92,10.29 72.68,9.53 75.89,9.53 75.99,9.42 76.32,9.42 D6.1 76.42,9.75 v1(77.6,10.92) ; 66.76,9.31 v1(64.64,11.43) ; D1.2 54.23,23.92 v1(54.23,22.73) ; v1(82.93,11.18) 85.22,8.89 D4.1
  Top Layer w1: C10.2 96.87,10.45 D4.1
  Bottom Layer w0.5: v1(82.93,11.18) 77.85,11.18 v1(77.6,10.92) ; v1(54.23,22.73) 54.23,21.84 v1(64.64,11.43)
VBUSINESP: length 62.8
  Top Layer w0.3: U14.9 122.97,23.59 123.04,23.52 123.04,23.24 123.22,23.06 123.54,23.06 v1(123.7,22.91)
  Top Layer w0.5: D3.1 136.65,12.19 136.52,12.32 136.52,18.53 135.37,19.68 135.37,20.07 134.87,20.57 128.27,20.57 127.35,21.5 127.35,31.49 U15.3 ; v1(126.22,21.59) 126.81,21.59 126.87,21.65 ; C2.2 113.67,8.54 113.54,8.41 113.41,8.54 D5.1
  Top Layer w1: U10.2 117.45,8.54 113.67,8.54 ; C27.2 123.62,31.99 U15.3
  Bottom Layer w0.3: v1(123.7,22.91) 124.7,22.91 124.97,22.63 125.18,22.63 v1(126.22,21.59) 125.49,20.86 125.48,20.86 121.28,16.67 121.28,14.76 118.87,12.35 118.87,9.4 U10.2
#EN: length 68.1
  Top Layer w0.254: 121.67,55 120.65,55 119.63,53.97 U10.20
  Top Layer w0.3: C25.2 138.75,31.88 v1(137.92,31.88) ; v1(120.65,53.97) 121.67,55 U1.3 ; Q3.3 140.02,29.49 140.02,30.41 140.67,30.41 140.81,30.28 140.81,29.98 140.97,29.82 140.97,25.96 141.18,25.74 141.18,24.3 139.16,22.28 139.16,10.26 138.44,9.53 138.44,9.28 ; v1(137.16,35.31) v1(135.38,37.08) ; C14.2 140.08,7.81 SW3.2 138.57,9.28 138.44,9.28 ; 138.44,9.28 R13.1
  Bottom Layer w0.3: v1(137.16,35.31) 137.92,34.54 v1(137.92,31.88) ; v1(120.65,53.97) 120.73,53.89 120.73,51.07 134.24,37.56 134.24,37.48 134.8,36.92 135.22,36.92 v1(135.38,37.08)
D_N: length 38.5
  Top Layer w0.2: 120.09,16.84 119.28,16.84 119.17,16.95 110.18,16.95 109.04,18.09 SW5.4
  Top Layer w0.3: v1(120.4,12.83) 119.63,13.59 119.63,16.38 120.2,16.95 U11.14 ; 130.31,7.26 130.54,7.49 131.09,7.49 131.31,7.27 USBC2.A7 ; 130.31,7.26 130.31,7.73 v1(130.39,7.8) ; 130.31,7.26 USBC2.B7
  Bottom Layer w0.3: v1(120.4,12.83) 120.4,11.81 121.07,11.13 121.07,10.83 120.79,10.54 120.79,10.24 120.91,10.12 121.21,10.12 121.5,10.41 121.8,10.41 121.92,10.28 121.92,9.98 121.38,9.44 121.38,9.14 121.5,9.02 121.8,9.02 122.35,9.56 122.65,9.56 123.09,9.12 129.01,9.12 130.33,7.8 v1(130.39,7.8)
D_P: length 38.4
  Top Layer w0.2: v1(120.99,13.46) 120.95,13.42 120.95,12.6 120.63,12.27 120.17,12.27 119.84,12.6 119.84,12.71 118.17,14.39 117.29,14.39 116.37,13.46 109.6,13.46 108.53,12.39 SW5.1
  Top Layer w0.3: 131.83,5.84 131.77,5.78 131.77,5.76 131.59,5.59 131.04,5.59 130.81,5.81 USBC2.A6 ; U11.15 120.52,16.45 120.21,16.13 120.21,14.76 120.86,14.11 120.86,13.6 v1(120.99,13.46) ; USBC2.B6 131.83,6.55 v1(131.83,7.62)
  Bottom Layer w0.3: v1(131.83,7.62) 129.79,9.65 123.2,9.65 121.03,11.82 121.03,13.42 v1(120.99,13.46)
DNIN: length 15.7
  Top Layer w0.2: SW5.5 103.89,17.84 104.14,17.59 104.14,14.1 104.74,13.49 104.74,11.01 104.14,10.41 104.14,7.51 ; v1(103.08,7.49) 103.08,6.21 USBC3.B7 ; v1(104.52,7.49) 104.16,7.49 104.14,7.51 ; USBC3.A7 104.14,7.51
  Bottom Layer w0.2: v1(103.08,7.49) v1(104.52,7.49)
DPIN: length 13.7
  Top Layer w0.2: USBC3.B6 104.65,6.14 104.65,5.51 104.34,5.21 103.93,5.21 103.64,5.5 USBC3.A6 103.64,8.01 103.49,8.15 103.02,8.15 102.88,8.29 102.88,8.41 103.02,8.55 103.49,8.55 103.64,8.69 103.64,8.81 103.49,8.95 102.9,8.95 102.76,9.09 102.76,9.21 102.9,9.35 103.49,9.35 103.64,9.49 103.64,9.61 103.49,9.75 103.04,9.75 102.9,9.89 102.9,10.01 103.04,10.15 103.49,10.15 103.64,10.29 103.64,10.41 103.49,10.55 103.04,10.55 102.9,10.69 102.9,10.81 103.04,10.95 103.28,10.95 103.89,11.56 SW5.2
DTR: length 17.8
  Top Layer w0.3: v1(125.22,23.24) 124.96,23.24 U14.12 ; v1(136.02,26.42) 136.67,26.42 Q2.2 138.57,25.11 R24.2
  Bottom Layer w0.3: v1(136.02,26.42) 135.23,25.63 133.23,25.63 132.87,25.27 132.87,24.77 132.98,24.66 132.98,23.37 132.84,23.24 v1(125.22,23.24)
EIO0: length 49.4
  Top Layer w0.254: U9.14 144.4,26.92 142.62,28.7 142.62,30.74 142.54,30.81 142.54,34.87 141.18,36.23 141.18,39.66 U1.27
  Top Layer w0.3: U9.14 144.4,25.65 v1(140.46,21.72) ; v1(138.3,18.92) 138.05,18.67 138.05,15.87 v1(137.67,15.49) ; v1(127,10.41) 125.85,10.41 R14.1 123.41,9.52 SW4.2
  Bottom Layer w0.3: v1(140.46,21.72) 140.46,21.08 v1(138.3,18.92) ; v1(137.67,15.49) 132.59,10.41 v1(127,10.41)
EIO1: length 36.6
  Top Layer w0.254: U1.39 140.36,55.72 140.68,55.72 140.84,55.56 140.84,55.24 144.4,51.68 U9.4
  Top Layer w0.3: Q2.3 136.02,29.91 C26.2 137.35,32.64 v1(141.86,32.64)
  Bottom Layer w0.3: v1(141.86,32.64) 141.86,33.66 141.35,34.17 141.35,40.2 142.26,41.11 142.26,49.17 U9.4
EIO2: length 8.8
  Top Layer w0.254: U1.38 139.81,54.71 140.07,54.45 140.68,54.45 140.84,54.29 140.84,54 142.62,52.23 142.62,50.04 143.89,48.77 U9.5
EIO3: length 14.5
  Top Layer w0.3: v1(122.05,38.86) 123.2,38.86 U1.15
  Bottom Layer w0.3: v1(122.05,38.86) 122.05,35.56 119.38,32.89 119.38,30.23 U10.10
EIO4: length 19.2
  Top Layer w0.2: H11.2 111.63,51.43 U10.19
  Top Layer w0.254: U1.4 122.18,53.59 121.28,53.59 119.13,51.43 U10.19
EIO5: length 19.7
  Top Layer w0.2: 106.3,54.23 111.63,48.89 U10.18
  Top Layer w0.254: U1.5 122.18,52.32 121.79,52.32 118.36,48.89 U10.18
EIO6: length 17.7
  Top Layer w0.254: U1.6 121.95,51.19 117.73,46.96 U10.17
  Bottom Layer w0.2: U10.17 114.81,49.28 114.81,52.58 113.15,54.24 H12.3
EIO7: length 14
  Top Layer w0.2: U10.16 117.69,43.81 116.68,42.8 116.68,41.49 115.62,40.43 114.31,40.43 U16.1
  Top Layer w0.254: U10.16 117.73,44.83 118.96,46.06 118.96,46.95 121.92,49.92 U1.7
EIO8: length 14.6
  Top Layer w0.254: U10.11 119.38,32.77 119.38,37.59 120.74,38.95 120.74,42.38 121.92,43.56 122.31,43.56 U1.12
EIO9: length 20.4
  Top Layer w0.3: U1.17 126.1,39.23 126.1,38.87 125.92,38.69 125.57,38.69 124.72,37.85 v1(124.33,37.85)
  Bottom Layer w0.3: v1(124.33,37.85) 124.33,37.59 123.08,36.34 123.08,35.2 120.27,32.38 120.27,27.02 117.73,24.48 U10.8
EIO10: length 23.3
  Top Layer w0.3: U1.18 127.37,39.23 127.37,38.87 127.19,38.69 126.84,38.69 125.99,37.85 v1(125.86,37.85)
  Bottom Layer w0.3: v1(125.86,37.85) 123.49,35.47 123.49,34.97 120.67,32.15 120.67,26.69 118.87,24.89 118.87,23.08 117.73,21.94 U10.7
EIO11: length 26.3
  Top Layer w0.3: v1(127.38,38.09) 127.5,38.09 128.11,38.69 128.46,38.69 128.64,38.87 128.64,39.23 U1.19
  Bottom Layer w0.3: U10.6 117.73,19.4 119.38,21.05 119.38,24.76 121.07,26.46 121.07,31.78 v1(127.38,38.09)
EIO12: length 29.4
  Top Layer w0.3: U1.20 129.91,39.23 129.91,38.87 129.73,38.69 129.38,38.69 128.77,38.09 v1(128.65,38.09)
  Bottom Layer w0.3: v1(128.65,38.09) 121.48,30.91 121.48,26.29 119.78,24.6 119.78,18.91 117.73,16.86 U10.5
EIO13: length 32.5
  Top Layer w0.3: U1.21 131.18,39.23 131.18,38.87 131,38.69 130.65,38.69 130.04,38.09 v1(129.92,38.09)
  Bottom Layer w0.3: U10.4 117.73,14.32 120.18,16.77 120.18,24.43 121.88,26.12 121.88,30.04 v1(129.92,38.09)
EIO14: length 35.5
  Top Layer w0.3: v1(131.32,38.1) 131.32,38.1 131.92,38.69 132.27,38.69 132.45,38.87 132.45,39.23 U1.22
  Bottom Layer w0.3: v1(131.32,38.1) 122.28,29.06 122.28,25.96 120.59,24.27 120.59,14.63 117.73,11.78 U10.3
EIO15: length 14.5
  Top Layer w0.2: U10.15 116.02,39.56 U16.16
  Top Layer w0.254: U10.15 117.73,42.29 119.31,43.87 119.31,46.04 121.79,48.51 122.18,48.51 U1.8
EIO16: length 17.1
  Top Layer w0.2: U10.14 117.35,38.35 112.9,38.35 112.44,38.82 U16.14
  Top Layer w0.254: U1.9 121.95,47.38 119.67,45.09 119.67,41.69 117.73,39.75 U10.14
EIO17: length 110.3
  Top Layer w0.2: v1(38.48,30.86) 38.4,30.94 34.82,30.94 34.33,30.45 U7.3
  Top Layer w0.254: U10.13 117.73,37.21 120.03,39.51 120.03,44.21 121.92,46.11 U1.10
  Bottom Layer w0.2: U10.13 117.73,35.94 104.57,22.78 83.93,22.78 83.9,22.82 63.21,22.82 58.67,27.35 58.67,32.51 57.32,33.87 55.33,33.87 H13.4 52.32,30.86 v1(38.48,30.86)
EIO18: length 109.1
  Top Layer w0.2: v1(37.21,30.23) 37.15,30.16 36,30.16 35.56,30.61 34.99,30.61 U7.2
  Top Layer w0.254: U1.11 121.92,44.84 120.38,43.29 120.38,39.23 118.87,37.72 118.87,35.81 117.73,34.67 U10.12
  Bottom Layer w0.2: v1(37.21,30.23) 54.23,30.23 H13.5 58.37,31.16 58.37,27.23 63.12,22.48 104.69,22.48 115.87,33.65 U10.12
EIO19: length 56.8
  Top Layer w0.3: U11.11 122.11,18.86 121.43,19.53 119.84,19.53 119.28,20.1 119.28,22.51 119.34,22.57 119.34,22.9 119.28,22.96 119.28,24.01 119.34,24.08 119.34,24.56 119.28,24.63 119.28,25.68 119.34,25.75 119.34,26.07 119.28,26.13 119.28,27.19 119.34,27.25 119.34,30.64 120.16,31.45 120.16,31.79 120.27,31.9 120.27,37.38 120.61,37.72 v1(120.9,37.72) ; 121.19,19.53 v1(121.19,19.97) ; v1(123.19,20.19) 125.48,17.91 v1(125.6,17.91) ; v1(121.32,42.14) 122.15,42.14 U1.13
  Bottom Layer w0.3: v1(125.6,17.91) 125.81,18.11 136.95,18.11 U9.20 ; v1(121.32,42.14) 121.32,38.14 v1(120.9,37.72) ; v1(121.19,19.97) 121.19,19.81 121.54,19.46 122.68,19.46 123.29,20.07 123.29,20.1 v1(123.19,20.19)
EIO20: length 54
  Top Layer w0.3: 121.61,18.22 121.54,18.29 120.52,18.29 118.83,19.98 118.83,30.69 119.76,31.62 119.76,37.43 121.12,38.79 121.12,39.83 U1.14 ; 121.61,18.22 121.61,18.5 v1(121.19,18.92) ; 121.61,18.22 U11.12 ; v1(125.22,19.05) 124.08,20.19 v1(124.08,20.45)
  Bottom Layer w0.3: v1(124.08,20.45) 123.8,20.16 123.8,19.94 122.77,18.92 v1(121.19,18.92) ; v1(125.22,19.05) 125.76,18.51 137.12,18.51 142.43,13.21 U9.19
EIO21: length 29
  Top Layer w0.3: v1(138.43,36.58) 137.41,36.58 135.29,38.69 134.93,38.69 134.76,38.87 134.76,39.23 U1.23
  Bottom Layer w0.3: U9.18 141.61,18.54 141.61,29.84 138.43,33.02 v1(138.43,36.58)
EIO35: length 15.9
  Top Layer w0.254: U1.28 140.36,41.75 140.68,41.75 141.54,40.89 141.54,36.39 142.9,35.03 142.9,30.96 144.4,29.46 U9.13
EIO36: length 14.7
  Top Layer w0.254: U9.12 144.4,32 143.26,33.14 143.26,35.18 141.9,36.54 141.9,41.81 140.68,43.02 140.36,43.02 U1.29
EIO37: length 13.4
  Top Layer w0.254: U9.11 144.4,34.54 142.25,36.69 142.25,42.72 140.68,44.29 140.36,44.29 U1.30
EIO38: length 38
  Top Layer w0.254: U9.10 144.4,37.08 142.61,38.87 142.61,43.64 140.68,45.56 140.36,45.56 U1.31
  Top Layer w0.3: v1(131.44,25.15) 130.99,24.69 130.34,24.69 130.17,24.51 130.17,23.46 130.34,23.28 131.68,23.28 R20.1 ; v1(141.96,34.42) 141.58,34.04 136.78,34.04 134.93,32.19 133.92,32.19 v1(131.57,29.84)
  Bottom Layer w0.3: v1(141.96,34.42) 143.38,34.42 144.4,35.43 U9.10 ; v1(131.57,29.84) 131.44,29.72 v1(131.44,25.15)
EIO39: length 10.9
  Top Layer w0.254: U1.32 140.36,46.83 140.68,46.83 142.96,44.55 142.96,41.06 144.4,39.62 U9.9
EIO40: length 9.6
  Top Layer w0.254: U1.33 140.36,48.1 140.68,48.1 140.84,47.94 140.84,47.62 143.32,45.14 143.32,43.24 144.4,42.16 U9.8
EIO41: length 11.9
  Top Layer w0.254: U9.7 144.4,44.7 143.32,45.78 143.32,46.73 140.68,49.37 140.36,49.37 U1.34
  Top Layer w0.5: U9.7 H8.1
EIO42: length 10.8
  Top Layer w0.254: U1.35 140.45,51.19 144.4,47.24 U9.6
  Top Layer w0.5: U9.6 H8.2
EIO45: length 19.8
  Top Layer w0.3: v1(140.33,38.86) 138.96,38.86 U1.26
  Bottom Layer w0.3: v1(140.33,38.86) 140.33,33.01 143,30.35 143,24.76 U9.15
EIO46: length 17.7
  Top Layer w0.3: U1.16 124.83,39.23 124.83,38.87 124.65,38.69 124.3,38.69 123.7,38.1 v1(122.68,38.1)
  Bottom Layer w0.3: U10.9 119.78,28.09 119.78,32.66 122.68,35.56 v1(122.68,38.1)
EIO47: length 26
  Top Layer w0.3: U1.24 135.51,39.39 136.2,38.69 136.94,38.69 138.29,37.34 v1(139.06,37.34)
  Bottom Layer w0.3: v1(139.06,37.34) 139.17,37.23 139.17,33.04 142.09,30.12 142.09,20.59 U9.17
EIO48: length 23
  Top Layer w0.3: v1(139.7,38.1) 138.1,38.1 136.78,39.42 U1.25
  Bottom Layer w0.3: U9.16 142.49,22.73 142.49,30.29 139.7,33.08 v1(139.7,38.1)
EIORX: length 51.2
  Top Layer w0.3: R22.1 119.76,26.92 119.76,29.46 120.4,30.1 125.6,30.1 126.62,29.08 v1(126.62,26.03) ; v1(141.86,51.56) 141.06,51.56 140.69,51.94 140.33,51.94 U1.36
  Bottom Layer w0.3: v1(126.62,26.03) 141.86,41.27 v1(141.86,51.56) 144.14,53.85 U9.3
EIOTX: length 49.2
  Top Layer w0.3: R23.1 120.42,21.98 v1(121.19,21.21) ; U1.37 140.08,53.73 140.59,53.21 140.69,53.21 140.87,53.03 140.87,52.81 v1(141.22,52.45)
  Bottom Layer w0.3: v1(121.19,21.21) 121.19,21.21 121.19,23.11 121.54,23.47 123.03,23.47 141.22,41.66 v1(141.22,52.45) 141.22,53.21 U9.2
ESP3V3: length 14.6
  Top Layer w0.3: R14.2 126.06,9.12 134.08,9.12 135.51,10.54 138.18,10.54 R13.2
GPIO2: length 18.7
  Top Layer w0.2: v1(37.34,31.5) 37.14,31.3 34.48,31.3 33.98,30.8 U7.4
  Bottom Layer w0.2: H13.3 50.42,31.5 47.82,31.5 47.69,31.36 45.53,31.36 45.4,31.5 v1(37.34,31.5)
GPIO3: length 16.8
  Top Layer w0.2: U7.5 34.39,31.7 36.45,31.7 37.13,32.38 v1(38.23,32.38)
  Bottom Layer w0.2: H13.2 48.77,32.38 48.28,32.38 47.56,31.66 45.65,31.66 44.93,32.38 v1(38.23,32.38)
GPIO4: length 55.2
  Top Layer w0.2: 41.15,34.92 41.4,35.18 41.4,43.05 42.8,44.45 42.8,49.15 45.85,52.2 56.93,52.2 60.74,56.01 U18.7 ; 41.15,34.92 44.45,34.92 H13.1 ; 41.15,34.92 39.24,34.92 36.32,32 34.16,32 33.45,31.3 U7.6
  Top Layer w1: U18.7 U21.7
GPIO5: length 44.3
  Top Layer w0.2: 33.13,31.58 33.98,32.43 35.36,32.43 36.78,33.85 36.78,35.23 40.64,39.09 H14.5
  Top Layer w1: U19.1 U20.1
  Bottom Layer w0.2: H14.5 44.2,42.29 60.07,42.29 U20.1
GPIO6: length 54.5
  Top Layer w0.2: H14.4 35.05,48.39 28.32,41.66 v1(28.31,41.66) ; U7.8 32.92,31.86 33.78,32.73 34.25,32.73 34.58,33.06 34.58,33.18 v1(34.8,33.4)
  Bottom Layer w0.2: U22.2 7.87,47.77 7.87,47.3 13.38,41.8 13.38,40.82 14.02,40.17 15,40.17 15.65,39.53 19.87,39.53 22,41.66 v1(28.31,41.66) 28.31,40.74 34.8,34.25 v1(34.8,33.4)
GPIO7: length 56.8
  Top Layer w0.2: v1(34.02,33.29) 33.71,33.29 U7.9 ; H14.3 35.43,50.93 27.69,43.18 v1(27.69,40.64)
  Bottom Layer w0.2: U22.1 8.07,45.36 8.27,45.16 8.27,43.5 9,42.78 9,41.32 12.11,38.2 19.54,38.2 22.67,41.32 27,41.32 v1(27.69,40.64) 31.98,36.34 32.27,36.34 33.09,35.53 33.09,34.76 34.04,33.8 34.04,33.31 v1(34.02,33.29)
GPIO8: length 53.6
  Top Layer w0.2: H14.2 37.34,53.47 26.67,42.8 v1(26.67,40.77) ; U7.11 32.99,33.7 32.99,34.45 v1(32.51,34.92)
  Bottom Layer w0.2: v1(32.51,34.92) 32.51,35.68 32.15,36.04 31.4,36.04 v1(26.67,40.77) 22.9,40.77 20.03,37.9 11.99,37.9 8.69,41.19 8.69,41.44 8.32,41.81 U2.2
GPIO9: length 63.7
  Top Layer w0.2: v1(25.91,40.13) 25.91,43.02 38.9,56.01 H14.1 ; U7.12 32.25,33.53 32.26,33.53 32.37,33.64 32.37,33.97 v1(32.43,34.04)
  Bottom Layer w0.2: v1(32.43,34.04) 32.43,34.22 26.52,40.13 v1(25.91,40.13) 25.86,40.08 25.86,33.16 22.42,29.72 17.57,29.72 8.02,39.27 U2.1
GPIO10: length 101.1
  Top Layer w0.2: U7.13 31.88,33.72 31.88,34.27 31.95,34.34 31.95,35.16 32.76,35.96 v1(33.91,35.96) 33.87,36.01 33.87,36.75 31.15,39.47 25.68,39.47 19.49,45.66 19.49,51.75 19.56,51.82 33.15,51.82 H15.5
  Bottom Layer w0.2: H9.1 79.68,28.15 63.76,28.15 56.72,35.18 34.69,35.18 v1(33.91,35.96)
GPIO11: length 97.3
  Top Layer w0.2: 32.82,36.52 v1(33.31,36.52) ; 32.82,36.52 30.26,36.52 27.62,39.16 25.48,39.16 19.19,45.45 19.19,52.13 19.3,52.24 31.03,52.24 H15.4 ; 32.82,36.52 31.15,34.86 31.15,33.56
  Bottom Layer w0.2: v1(33.31,36.52) 36.3,36.52 37.34,35.48 56.85,35.48 63.88,28.45 H9.2
GPIO12: length 77.5
  Top Layer w0.2: v1(12.78,30.95) 12.44,31.29 12.44,50.49 14.49,52.54 27.78,52.54 30.14,54.9 30.17,54.9 30.82,55.55 30.82,55.58 31.24,56.01 H15.3 ; v1(26.42,38.61) 27.21,38.61 27.8,38.02 28.34,38.02 29.64,36.72 29.64,36.18 29.84,35.97 29.84,35.81 29.72,35.69 29.72,34.42 29.34,34.04 29.34,34.03 U7.15
  Bottom Layer w0.2: U5.2 v1(12.78,30.95) 14.39,29.34 22.47,29.34 26.42,33.29 v1(26.42,38.61)
GPIO13: length 75.4
  Top Layer w0.2: U7.16 28.87,33.93 28.87,34.02 29.34,34.49 29.34,36.32 29.15,36.51 29.15,36.78 28.29,37.64 28.02,37.64 27.94,37.72 v1(27.05,37.72) ; H15.2 29.46,56.01 26.3,52.85 14.37,52.85 12.13,50.61 12.13,30.03 v1(13.21,28.96)
  Bottom Layer w0.2: v1(27.05,37.72) 27.05,33.49 22.51,28.96 v1(13.21,28.96) 12.23,28.96 U5.1
GPIO14: length 73.7
  Top Layer w0.2: U7.17 28.57,33.67 28.57,34.15 29,34.57 29,35.9 28.85,36.05 28.85,36.65 28.52,36.98 27.92,36.98 v1(27.81,37.08) ; v1(13.21,27.88) 11.83,29.26 11.83,50.74 14.24,53.15 24.32,53.15 H15.1
  Bottom Layer w0.2: 8,29.63 8,28.87 8.99,27.88 v1(13.21,27.88) 15.69,27.88 16.45,28.64 23.39,28.64 23.65,28.9 23.65,29.18 24.16,29.69 24.44,29.69 27.69,32.94 27.69,36.19 27.74,36.25 27.74,36.65 27.81,36.73 v1(27.81,37.08)
GPIO15: length 70.3
  Top Layer w0.2: v1(13.08,26.81) 11.53,28.37 11.53,50.86 14.12,53.45 20.94,53.45 23.62,56.13 ; U7.18 28.27,33.4 28.27,34.27 28.7,34.7 28.7,35.66 28.45,35.91 28.45,36.27 v1(28.29,36.42)
  Bottom Layer w0.2: v1(28.29,36.42) 28.17,36.29 28.17,32.36 25.19,29.39 24.28,29.39 23.95,29.06 23.95,28.6 23.69,28.34 16.58,28.34 15.06,26.81 v1(13.08,26.81) 8.28,26.81 8,27.09
GPIO16: length 59.9
  Top Layer w0.2: 26.41,30.16 26.35,30.16 25.92,30.59 25.71,30.59 24.51,29.4 v1(24.51,28.83) ; 21.08,56.13 18.7,53.75 13.99,53.75 11.23,50.99 11.23,26.21 v1(12.32,25.12)
  Bottom Layer w0.2: 8,24.42 9.76,24.42 10.45,25.12 v1(12.32,25.12) 13.78,25.12 16.7,28.04 23.95,28.04 24.51,28.6 v1(24.51,28.83)
GPIO17: length 61
  Top Layer w0.2: U7.28 25.78,30.23 25.07,29.51 25.07,28.37 v1(24.77,28.07) ; 18.54,56.13 16.46,54.05 13.87,54.05 10.92,51.11 10.92,23.14 v1(11.58,22.49)
  Bottom Layer w0.2: v1(24.77,28.07) 24.43,27.73 16.83,27.73 v1(11.58,22.49) 10.97,21.88 8,21.88
GPIO18: length 61.3
  Top Layer w0.2: v1(24.38,27.18) 24.77,27.18 U7.29 ; v1(10.9,20.35) 10.62,20.62 10.62,51.24 13.74,54.36 14.22,54.36 16,56.13
  Bottom Layer w0.2: v1(24.38,27.18) 24.26,27.3 17.19,27.3 10.9,21.01 v1(10.9,20.35) 8.88,18.33 U23.2
GPIO19: length 63.7
  Top Layer w0.2: 26.41,28.26 24.57,26.42 v1(24.13,26.42) ; 13.46,56.13 13.46,54.74 10.32,51.6 v1(10.32,18.38)
  Bottom Layer w0.2: v1(24.13,26.42) 17.46,26.42 14.17,23.13 13.51,23.13 11.94,21.57 11.94,19.94 10.39,18.38 v1(10.32,18.38) 8,16.06 U23.1
GPIO20: length 30.3
  Top Layer w0.2: U7.31 26.7,27.9 25.69,26.89 v1(25.78,26.8)
  Bottom Layer w0.2: 16.89,12.57 17.56,13.24 17.56,17.56 25.65,25.66 25.65,26.38 25.78,26.51 v1(25.78,26.8)
  Bottom Layer w0.3: H17.5 13.08,8.76 16.89,12.57 16.89,14.22 15.91,15.2 SW8.1
GPIO21: length 24.3
  Top Layer w0.2: v1(26.32,26.26) 26.32,26.54 26.34,26.56 26.34,27.05 26.98,27.69
  Bottom Layer w0.2: v1(26.32,26.26) 26.16,26.1 26.16,25.74 17.86,17.44 17.86,11.38 15.62,9.14 H17.4
GPIO22: length 23.1
  Top Layer w0.2: U7.34 27.55,27.06 27.12,26.63 27.12,25.98 v1(26.92,25.78)
  Bottom Layer w0.2: v1(26.92,25.78) 26.63,25.78 18.16,17.31 H17.3
GPIO26: length 21.2
  Top Layer w0.2: v1(27.69,24.51) 27.69,24.93 28.68,25.92 U7.38
  Bottom Layer w0.2: v1(27.69,24.51) 26.75,23.57 26.75,14.18 H17.2
GPIO27: length 20
  Top Layer w0.2: U7.39 28.35,25.1 28.35,24.19 28.27,24.1 v1(28.27,23.82)
  Bottom Layer w0.2: H17.1 23.24,10.16 27.05,13.97 27.05,22.25 28.27,23.46 v1(28.27,23.82)
GPIO28: length 18.1
  Top Layer w0.2: U7.40 28.81,25 28.81,24.72 28.91,24.63 v1(28.91,24.26)
  Bottom Layer w0.2: H1.5 27.43,22.2 28.88,23.65 28.88,24.11 28.91,24.14 v1(28.91,24.26)
MAXVDD: length 134.9
  Top Layer w0.2: 114.98,46.01 115.17,46.21 115.71,46.21 115.82,46.1 115.82,42.67 v1(115.06,41.91) 114.29,41.91
  Top Layer w0.3: U16.4 114.29,41.91 114.98,42.6 R28.1 ; 112.14,42.56 U16.8 ; 112.14,42.56 U16.7 ; 112.14,42.56 111.86,42.84 C36.2 111.86,46.46 112.43,47.03 113.96,47.03 114.98,46.01 R28.2
  Top Layer w0.5: R21.2 135.9,23.37 R17.1 134.12,25.39 133.48,26.03 ; 129.98,29.52 129.98,33.59 129.29,34.29 U15.2 ; 129.98,29.52 133.48,26.03 ; 129.98,29.52 128.52,28.07 128.52,26.35 ; 128.52,26.35 128.42,26.25 U13.1 ; 128.52,26.35 C20.2 ; 133.48,26.03 v1(133.48,25.02) ; v1(132.59,19.68) 132.59,18.16 132.08,17.65 Q1.2
  Top Layer w1: 120.29,56.27 117.98,56.27 U10.21 117.46,56.78 H12.2 ; 120.29,56.27 120.28,56.27 C13.2 ; 120.29,56.27 U1.2 ; v1(121.28,35.94) 122.17,35.05 C30.2 125.98,35.05 126.75,34.29 U15.2
  Bottom Layer w0.2: 119.25,42.45 115.6,42.45 v1(115.06,41.91)
  Bottom Layer w0.5: 119.13,55.12 141.43,55.12 143.9,57.59 144.9,57.59 145.6,56.89 145.6,51.12 H8.3 ; v1(132.59,19.68) 133.48,20.57 v1(133.48,25.02)
  Bottom Layer w1: v1(121.28,35.94) 119.25,37.97 119.25,54.99 U10.21 U10.22
NET15: length 1.6
  Top Layer w0.3: U16.9 109.69,41.81 L1.2
NET16: length 2
  Top Layer w0.3: L2.2 110.59,41.06 110.59,41.06 110.84,41.31 U16.10
QSPI_SCLK: length 16.9
  Top Layer w0.2: 37.53,19.51 36.95,18.92 36.44,18.92 35.63,19.73 35.63,21.11 39.67,25.15 39.67,25.93 38.78,26.83 34.28,26.83 U7.52
QSPI_SD0: length 14.7
  Top Layer w0.2: U7.53 34.05,27.69 34.61,27.13 38.91,27.13 39.97,26.07 39.97,25.02 35.93,20.98 35.93,20.4 36.63,20.4
QSPI_SD1: length 12.2
  Top Layer w0.2: U7.55 35.07,27.73 39.24,27.73 43.05,23.92 43.05,23.23 42.22,22.4
QSPI_SD2: length 10.7
  Top Layer w0.2: U7.54 34.8,27.43 39.12,27.43 41.99,24.55 41.99,23.97 41.33,23.3
QSPI_SD3: length 18.4
  Top Layer w0.2: U7.51 33.48,27.12 34.08,26.53 38.62,26.53 39.37,25.78 39.37,25.27 35.33,21.23 35.33,19.61 36.9,18.03 37.72,18.03 38.3,18.61 38.43,18.61 38.43,18.61
QSPI_SS: length 15.9
  Top Layer w0.2: R9.2 43.16,24.25 ; 43.16,24.25 43.93,23.48 43.93,22.31 43.12,21.5 ; 43.16,24.25 39.37,28.04 35.33,28.04 U7.56
RGB_CTRL: length 1.6
  Top Layer w0.5: U13.4 132.49,23.99 R20.2
RTS: length 22.7
  Top Layer w0.3: 140.4,26.71 140.4,25.96 140.78,25.58 140.78,24.46 140.6,24.28 138.04,24.28 137.3,25.02 R25.2 136.14,24.26 134.62,24.26 134.62,25.59 134.37,25.84 134.37,26.28 v1(133.35,27.3) ; v1(126.19,24.46) 125.19,24.46 U14.13
  Bottom Layer w0.3: v1(133.35,27.3) 132.05,26.01 132.05,24.89 131.7,24.54 131.19,24.54 131.09,24.64 126.36,24.64
RUN: length 21.7
  Top Layer w0.2: SW2.2 SW2.1 21.97,19.31 21.97,24.76 23.57,26.37 23.57,29.29 25.53,31.24 25.91,31.24 26.7,30.45 U7.26
SWCLK: length 17.9
  Top Layer w0.2: U7.24 26.14,32.13 25.27,32.13 23.88,30.73 23.37,30.73 22.48,31.62 22.48,33.64 18.54,37.57 18.54,40.26 19.56,41.27
SWDIO: length 19.3
  Top Layer w0.2: H7.3 14.99,40.77 14.99,40.59 22.18,33.4 22.18,31.5 23.24,30.43 24,30.43 25.4,31.83 26.02,31.83 26.55,31.3 26.55,31.23 26.98,30.8 26.98,30.73
USB2_N: length 6.7
  Top Layer w0.3: v1(122.55,22.86) 122.55,23.22 122.54,23.24 122.54,23.77 122.27,24.04 U14.8 ; U11.9 123.11,19.39 v1(122.43,20.07)
  Bottom Layer w0.3: v1(122.55,22.86) 122.55,20.19 v1(122.43,20.07)
USB2_P: length 8
  Top Layer w0.3: U11.10 122.61,19.25 122.4,19.46 122.18,19.46 121.82,19.81 121.82,20.42 v1(121.76,20.48) ; v1(121.79,22.86) 121.79,23.99 121.59,24.19 121.59,24.69 121.77,24.87 122.19,24.87 U14.7
  Bottom Layer w0.3: v1(121.79,22.86) 121.92,22.73 121.92,20.64 v1(121.76,20.48)
USB_DM: length 90.5
  Top Layer w0.2: v1(32.39,24.16) 32.89,24.66 32.89,24.86 32.47,25.27 32.44,25.27 U7.46 ; SW5.6 v1(100.08,18.09) ; USBC1.B7 70.79,6.45 v1(70.79,8.21) ; USBC1.A7 71.75,7.22 71.68,7.29 71.68,7.75 72.2,8.27 72.2,8.72 71.98,8.94 71.98,9.23 v1(71.66,9.55)
  Bottom Layer w0.2: v1(100.08,18.09) 100.08,13.84 98.98,12.74 75.74,12.74 72.55,9.55 v1(71.66,9.55) ; v1(71.66,9.55) 71.66,9.26 71.67,9.24 71.67,8.78 71.35,8.46 71.04,8.46 v1(70.79,8.21) ; v1(71.66,9.55) 71.33,9.88 71.04,9.88 70.84,10.08 47.24,10.08 33.36,23.96 33.06,23.96 32.85,24.16 v1(32.39,24.16)
USB_DP: length 90.7
  Top Layer w0.2: v1(32.39,23.4) 32.6,23.61 32.62,23.61 32.95,23.93 32.95,23.96 33.52,24.53 33.52,24.73 32.72,25.52 32.72,25.56 U7.47 ; SW5.3 v1(100.08,12.39) ; v1(71.12,9.01) 71.44,8.69 71.73,8.69 71.84,8.57 71.84,8.42 71.33,7.9 71.33,7.29 71.25,7.22 USBC1.A6 71.25,5.75 71.5,5.51 72.01,5.51 72.25,5.75 USBC1.B6
  Bottom Layer w0.2: v1(100.08,12.39) 75.89,12.39 75.66,12.16 75.66,11.96 75.72,11.91 75.72,11.71 75.64,11.63 75.44,11.63 75.38,11.68 75.18,11.68 75.1,11.6 75.1,11.4 75.15,11.34 75.15,11.14 75.07,11.06 74.87,11.06 74.82,11.12 74.62,11.12 74.53,11.03 74.53,10.83 74.59,10.78 74.59,10.58 74.5,10.5 74.3,10.5 74.25,10.55 74.05,10.55 73.97,10.47 73.97,10.27 74.02,10.21 74.02,10.01 73.94,9.93 73.74,9.93 73.68,9.98 73.48,9.98 71.92,8.41 71.8,8.41 71.49,8.1 71.47,8.1 71.02,7.65 70.56,7.65 70.23,7.97 70.23,8.44 70.56,8.76 70.85,8.76 70.89,8.81 70.91,8.81 v1(71.12,9.01) 70.94,9.01 70.66,9.29 70.66,9.41 70.48,9.58 47.06,9.58 33.08,23.56 32.93,23.56 32.72,23.35 32.44,23.35 v1(32.39,23.4)
V+: length 135.5
  Top Layer w1.5: C21.1 5.46,50.03 U22.3 U22.4 U2.3 U2.4 U5.3 U5.4 U23.3 U23.4 5.46,13.54 C3.1
  Top Layer w2: C15.1 80.53,19.3 D7.1 68.57,19.16 51.94,2.54 12.06,2.54 8.13,6.47 8.13,10.36
VSYS: length 67.4
  Top Layer w0.5: v1(63.37,29.97) 62.99,30.35 54.8,30.35 51.94,27.5 C1.2 50.56,26.73 ; 49.28,26.73 50,26.01 D1.1 ; 49.28,26.73 50.56,26.73 ; 49.28,26.73 48.7,26.73 48.33,27.11 U8.1 ; 50.56,26.73 50.23,27.07 U8.3
  Top Layer w1: D1.1 50.55,24.22 50.55,19.52 39.15,8.13 H1.1 ; U19.7 U20.7
  Bottom Layer w0.5: v1(63.37,29.97) 57.15,36.19 48.01,36.19 U19.7
XI: length 11.5
  Top Layer w0.3: R19.2 131.06,11.77 U12.1 130.24,11.87 C18.1 127.38,12.76 127.38,15.43 126.36,16.45 U11.4
XO: length 21
  Top Layer w0.3: R18.2 135.89,15.49 135.89,11.81 134.38,10.3 R19.1 132.32,10.3 131.58,9.57 129.3,9.57 127.52,11.35 127.52,12.06 126.98,12.6 126.98,15.26 126.29,15.95 U11.3
$1N1870: length 7.3
  Top Layer w0.2: 45.41,18.85 SW1.2 45.41,23.55 44.22,24.74 R9.1
$1N1872: length 9.9
  Top Layer w0.2: U7.21 28.08,31.86 27.66,32.28 27.66,34.52 28.09,34.95 28.09,35.41 27.2,36.3 26.24,36.3 25.24,35.31 24,35.31 23.45,35.85 X1.3
$1N1873: length 7.9
  Top Layer w0.2: 28.39,32.14 28.39,32.18 27.96,32.61 27.96,34.4 28.39,34.82 28.39,35.53 27.33,36.6 26.4,36.6 X1.1
$1N1896: length 2
  Top Layer w0.2: R7.1 24.59,25.02 24.07,25.02 LED2.1
$1N1897: length 2.8
  Top Layer w0.2: R7.2 26.73,24.61 28.39,26.28
$1N2181: length 2.2
  Top Layer w0.2: R12.2 73.23,8 73.25,7.98 USBC1.B5
$1N2182: length 2.5
  Top Layer w0.2: R11.2 70.23,8.31 70.23,7.97 70.25,7.95 USBC1.A5
$1N3810: length 4.8
  Top Layer w0.3: R15.2 R16.1 132.79,16.7 Q1.1
$1N3984: length 8.3
  Top Layer w0.3: Q1.3 130.94,18.22 130.66,18.22 130.49,18.04 130.49,17.76 129.42,16.7 Q1.6
  Top Layer w0.5: Q1.3 131.82,19.1 131.82,19.81 v1(131.83,19.81) ; R17.2 133.6,21.34 v1(132.59,21.34)
  Bottom Layer w0.5: v1(132.59,21.34) 131.83,20.57 v1(131.83,19.81)
$1N4724: length 4.4
  Top Layer w0.3: R18.1 134.75,15.12 C19.1 134.72,13.93 U12.3
$1N5316: length 2.6
  Top Layer w0.5: R21.1 136.88,21.73 LED3.1
$1N6114: length 3.8
  Top Layer w0.3: U14.4 122.84,26.77 121.38,26.77 120.02,25.4 R22.2
